# EAGLE design bob1 (EAGLE 5.07)
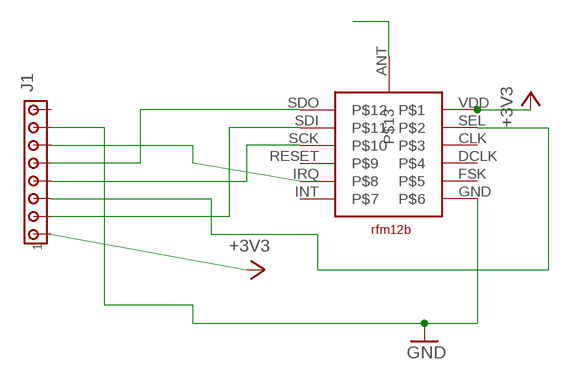
[diagram p0: schematic, sheet 1]

## Parts
J1  MTA08-100  [10X08MTA]
U$1  RFM12B  [HOPERFM12B]

## Nets
+3V3: J1.1 U$1.VDD
GND: J1.7 U$1.GND
IRQ: J1.6 U$1.IRQ
N$10: U$1.ANT
SCK: J1.4 U$1.SCK
SD0: J1.5 U$1.SDO
SDI: J1.2 U$1.SDI
SEL: J1.3 U$1.SEL
Unconnected: J1.8 U$1.CLK U$1.DCLK U$1.FSK U$1.INT U$1.RESET

## Library data of the parts
J1 = matt con-amp:MTA08-100: AMP connector
U$1 = matt:RFM12B

## Board
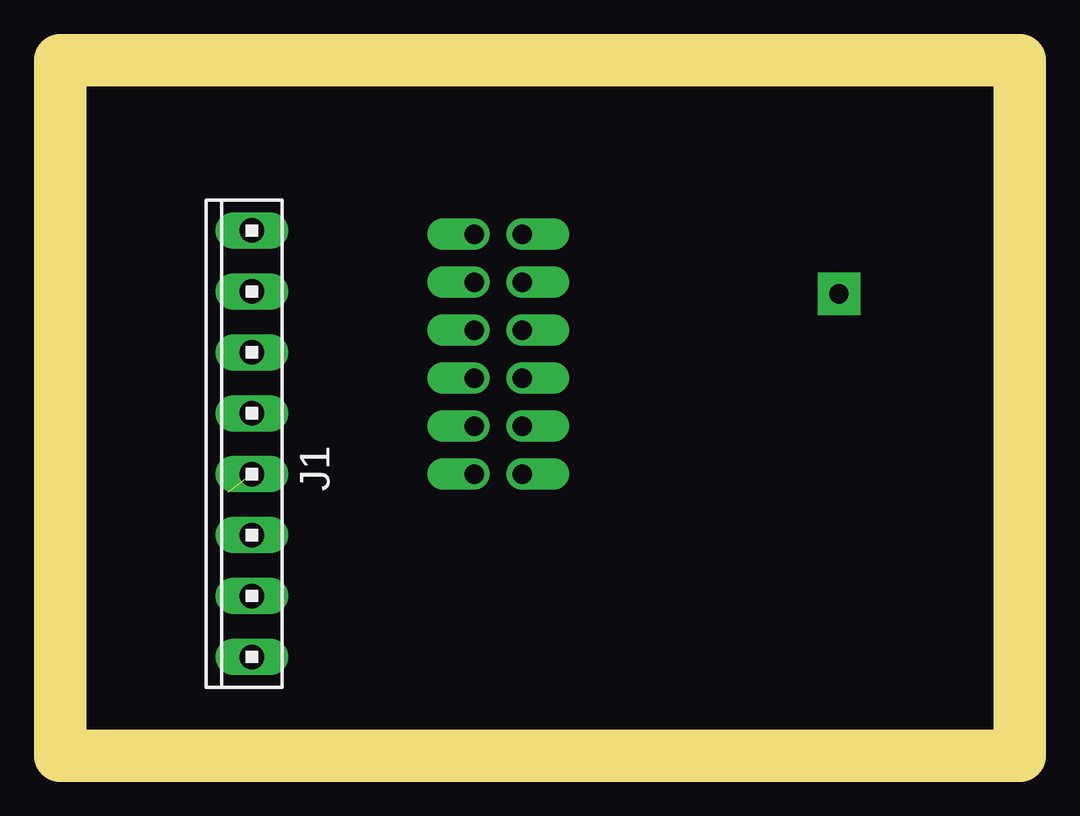
[diagram p1: board, top side]
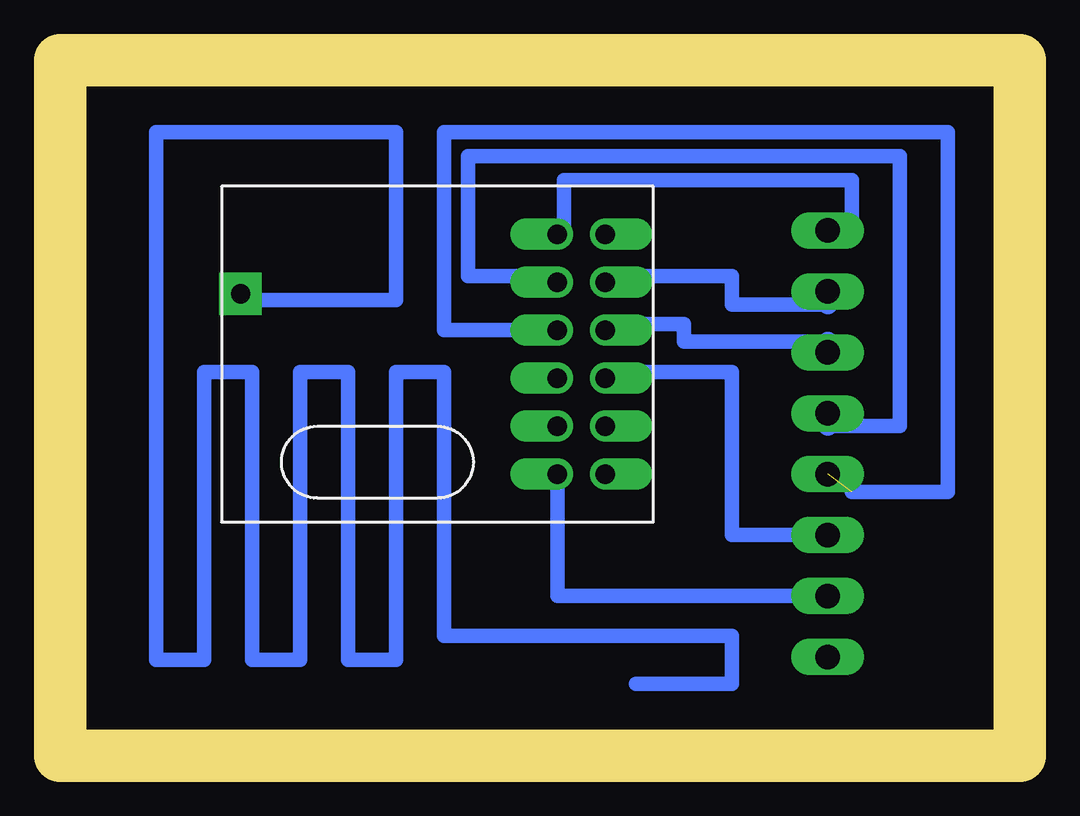
[diagram p2: board, bottom side, seen from below]

Size 40 x 29 mm. Coordinates in mm from the lower left corner, seen from the top.
Outline: 0,0 40,0 40,29 0,29 0,0
Copper layers (1*16): Top 0.035mm / dielectric 1.5mm / Bottom 0.035mm
Design rules "default": minimum track width 10mil, minimum drill 24mil, track to track 8mil, track to pad 8mil, pad to pad 8mil, via to via 8mil, smd to smd 8mil, copper to edge 40mil, drill to drill 8mil, minimum pad ring 10mil, minimum via ring 8mil, stop-mask expansion 4mil, vias tented up to drill 0mil, thermal gap 10mil
Milling: 4 lines

### Footprints (pad centres in the part's own frame; a part is rotated, then mirrored left to right if it is on the bottom)
10X08MTA = drill 1.016 long: 1 8.89,0; 2 6.35,0; 3 3.81,0; 4 1.27,0; 5 -1.27,0; 6 -3.81,0; 7 -6.35,0; 8 -8.89,0
HOPERFM12B = drill 0.8 pad 1.778 square: ANT -8.473,-2.254 | drill 0.8 offset: CLK 4.73,3.27; DCLK 6.73,3.27; FSK 4.73,1.27; GND 4.73,5.27; INT 6.73,-4.73; IRQ 6.73,1.27; RESET 6.73,5.27; SCK 4.73,-2.73; SDI 6.73,-2.73; SDO 4.73,-0.73; SEL 6.73,-0.73; VDD 4.73,-4.73

### Placement (x,y rotation side)
J1  8,13 90 top
U$1  24,17 180 top

### Tracks (layer width: path | path; a pad name or v marks a point on that pad's centre or on a via)
+3V3
  Bottom 0.61: U$1.VDD 19,21.73 19,24 7,24 7,21.89
  Bottom 0.813: J1.1 7,21.89
GND
  Bottom 0.61: J1.7 19.27,6.65 U$1.GND
IRQ
  Bottom 0.61: J1.6 12,9.19 12,16 17.27,16 U$1.IRQ
N$1
  Bottom 0.61: 32,19 26,19 26,26 36,26 36,4 34,4 34,16 32,16 32,4 30,4 30,16 28,16 28,4 26,4 26,16 24,16 24,5 12,5 12,3 16,3
SCK
  Bottom 0.61: U$1.SCK 19.27,20 23,20 23,25 5,25 5,13.73 8,13.73
  Bottom 0.813: 8,13.73 J1.4
SD0  (1 unrouted)
  Bottom 0.61: U$1.SDO 24,17.73 24,26 3,26 3,11 7,11
SDI
  Bottom 0.61: U$1.SDI 17.27,20 12,20 12,18.81 8,18.81
  Bottom 0.813: 8,18.81 J1.2
SEL
  Bottom 0.61: U$1.SEL 17.27,18 14,18 14,17.27 8,17.27
  Bottom 0.813: 8,17.27 J1.3